# EasyEDA Pro project Fan_12V_LED.epro

# Schematic Schematic2_2
Board Name: Board2_12V_LED; Create Date: 2025-06-06; Page Name: P1; Project Name: Fan; Schematic Name: Schematic2_2; Update Date: 2025-07-09; Company: 嘉立创EDA; Page Size: A4; Version: V1.0
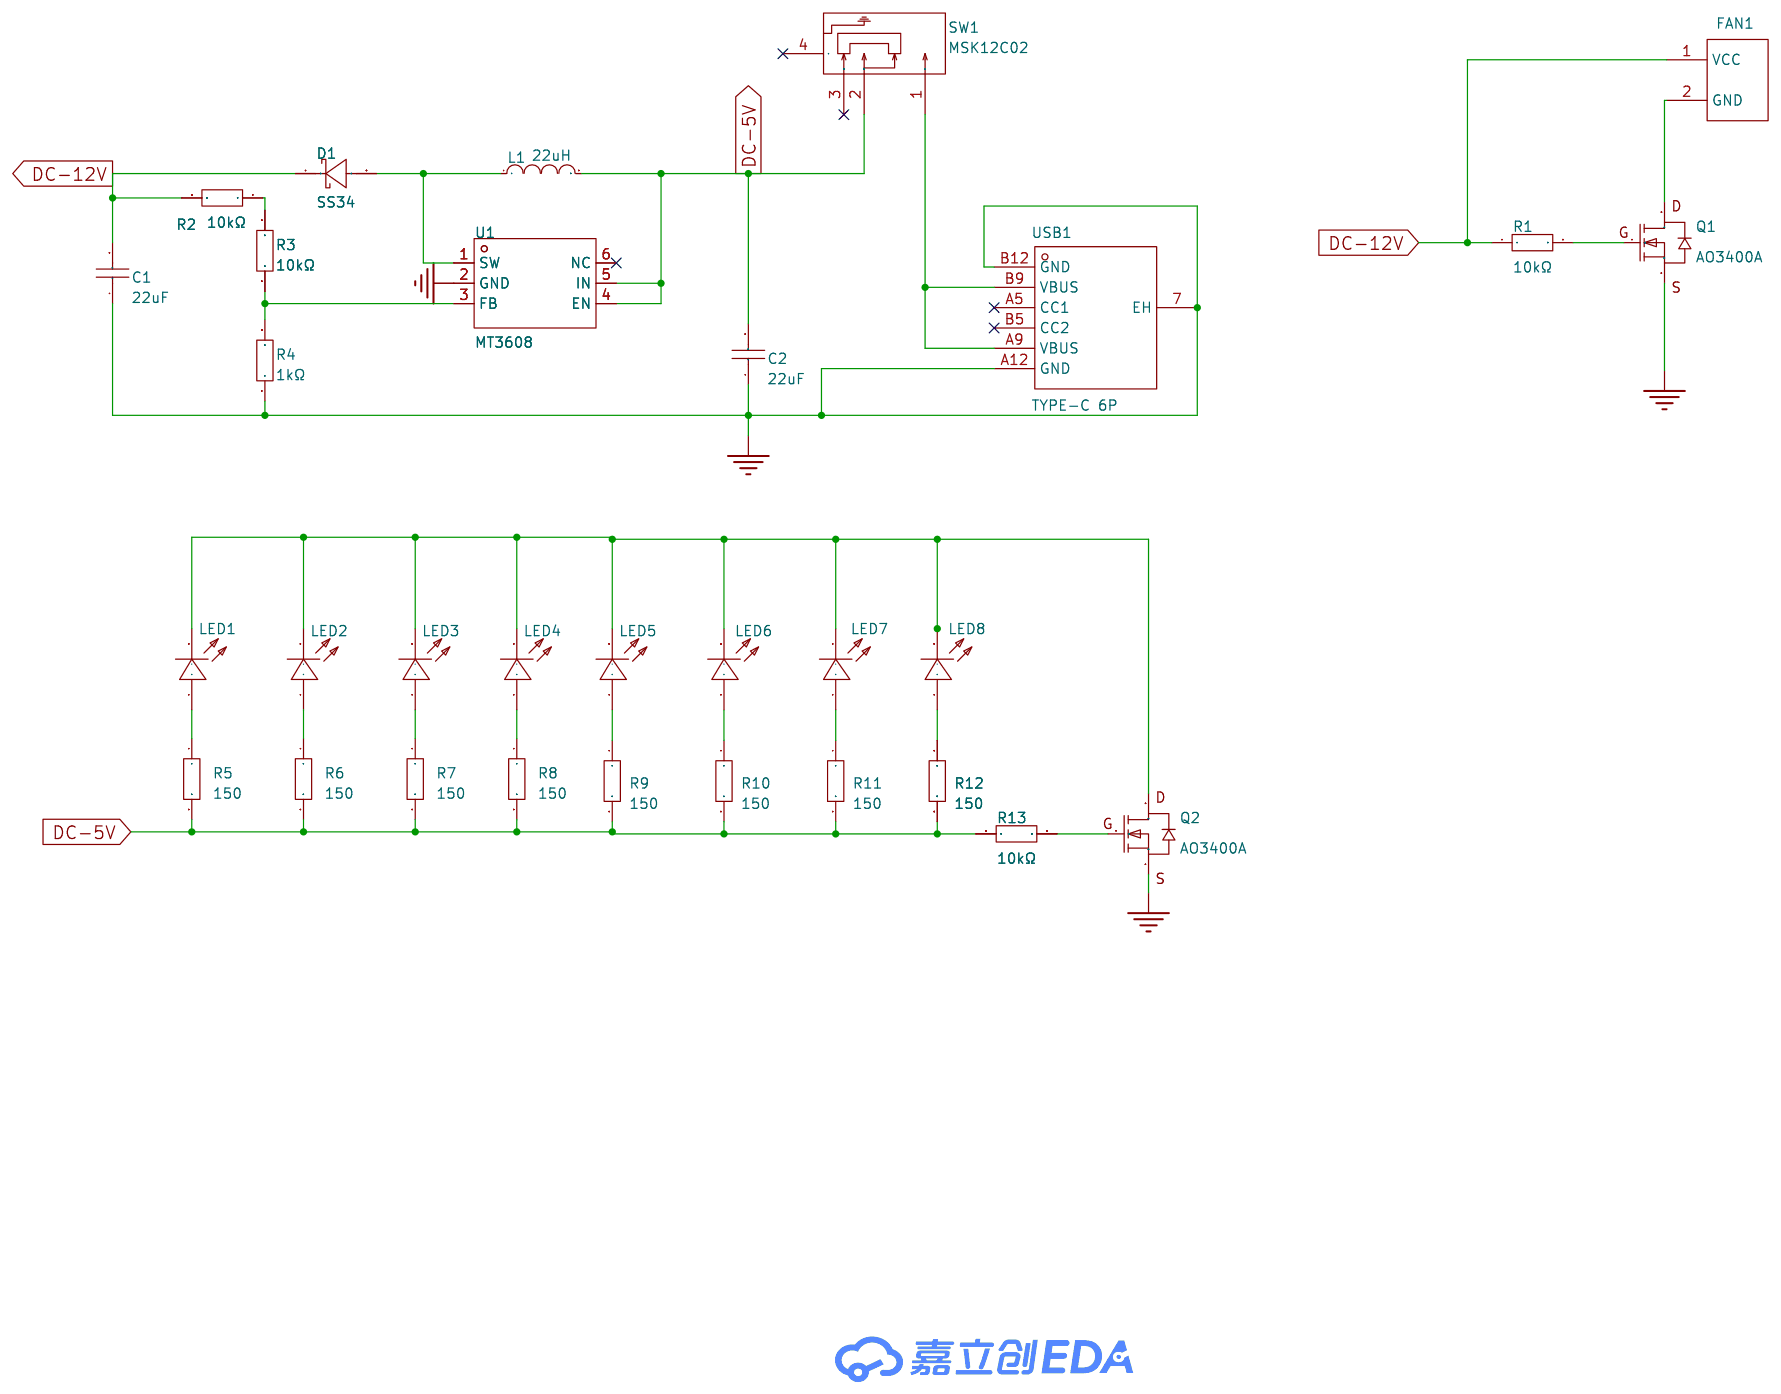
[diagram p0: schematic sheet]

## Parts
C1  22uF  [C0603]
C2  22uF  [C0603]
D1  SS34  [SMA_L4.2-W2.7-LS5.0-RD]
FAN1  -  [锂电池焊盘封装]
L1  22uH  [IND-SMD_L7.0-W6.6_FXL0630]
LED1  NCD0805R1  [LED0805-R-RD]
LED2  NCD0805R1  [LED0805-R-RD]
LED3  NCD0805R1  [LED0805-R-RD]
LED4  NCD0805R1  [LED0805-R-RD]
LED5  NCD0805R1  [LED0805-R-RD]
LED6  NCD0805R1  [LED0805-R-RD]
LED7  NCD0805R1  [LED0805-R-RD]
LED8  NCD0805R1  [LED0805-R-RD]
Q1  AO3400A  [SOT-23-3_L2.9-W1.3-P1.90-LS2.4-BR]
Q2  AO3400A  [SOT-23-3_L2.9-W1.3-P1.90-LS2.4-BR]
R1  10kΩ  [R0603]
R2  10kΩ  [R0603]
R3  10kΩ  [R0603]
R4  1kΩ  [R0603]
R5  150  [R0603]
R6  150  [R0603]
R7  150  [R0603]
R8  150  [R0603]
R9  150  [R0603]
R10  150  [R0603]
R11  150  [R0603]
R12  150  [R0603]
R13  10kΩ  [R0603]
SW1  MSK12C02  [SW-TH_MSK12C02]
U1  MT3608  [SOT-23-6_L2.9-W1.6-P0.95-LS2.8-BL]
USB1  TYPE-C 6P  [TYPE-C-SMD_TYPE-C-6P]

## Library data of the parts
C1 C2 = CC0603MRX5R5BB226: 容值:22uF;精度:±20%;额定电压:6.3V;材质(温度系数):X5R;; LCSC Part Name: 22uF ±20% 6.3V; Supplier Part: C109448; Manufacturer: YAGEO(国巨); Supplier Footprint: 0603; JLCPCB Part Class: 扩展库; Datasheet: https://atta.szlcsc.com/upload/public/pdf/source/20180326/C109448_EB54A0A53A47321976FFDA89D54F692E.pdf; Supplier: LCSC; Tolerance: ±20%; Voltage Rated: 6.3V; Temperature Coefficient: X5R
D1 = SS34_C2837271: 二极管配置:-;正向压降(Vf):550mV@3A;直流反向耐压(Vr):40V;整流电流:3A;; LCSC Part Name: 电压:40V 电流:3A; Supplier Part: C2837271; Manufacturer: JSMSEMI(杰盛微); Supplier Footprint: SMA(DO-214AC); JLCPCB Part Class: 扩展库; Datasheet: https://atta.szlcsc.com/upload/public/pdf/source/20240105/68F24DC3F5F89CC64C93FD752A02EDA3.pdf; Supplier: LCSC; Forward Voltage (Vf@If): 550mV@3A; Reverse Voltage (Vr): 40V; Rectified Current: 3A; Reverse Leakage Current (Ir): 500uA@40V
FAN1 = 锂电池焊盘
L1 = FXL0630-220-M: 电感值:22uH;精度:±20%;额定电流:2.5A;饱和电流(Isat):3A;类型:一体成型电感;; LCSC Part Name: 22uH ±20% 3A; Supplier Part: C177244; Manufacturer: cjiang(长江微电); Supplier Footprint: SMD,6.6x7mm; JLCPCB Part Class: 扩展库; Datasheet: https://atta.szlcsc.com/upload/public/pdf/source/20240426/3189EA8206330E2108542F9E34E540E7.pdf; Supplier: LCSC; Tolerance: ±20%; Rated Current: 2.5A; Saturation Current (Isat): 3A; DC Resistance (DCR): 200mΩ; Type: 一体成型电感
LED1-LED8 = NCD0805R1: 灯头类型:-;发光颜色:红色;正向电压(VF):1.6V~2.6V;功率:65mW;正向电流:20mA;主波长:615nm~630nm;二极管配置:独立二极管;透镜颜色:无色透明透镜;色温:-;发光强度:67mcd~195mcd;发光角度:130°;载带方式:-;工作温度:-30℃~+85℃;; Supplier Part: C84256; Manufacturer: 国星光电; Supplier Footprint: 0805; JLCPCB Part Class: 基础库; Datasheet: https://atta.szlcsc.com/upload/public/pdf/source/20200820/C84256_F0A75A43B3EAD75808600A0514C76B99.pdf; Supplier: LCSC; Emitted Color: 红色; Forward Voltage (VF): 1.6V~2.6V; Power Dissipation: 65mW; Forward Current: 20mA; Dominant Wavelength: 615nm~630nm; Diode Configuration: 独立二极管; Lens Color: 无色透明透镜; Luminous Intensity: 67mcd~195mcd; Viewing Angle: 130°; Operating Temperature: -30℃~+85℃
Q1 Q2 = AO3400A_C347475: 类型:1个N沟道;漏源电压(Vdss):30V;连续漏极电流(Id):5.8A;导通电阻(RDS(on)@Vgs,Id):28mΩ@10V,5.8A;功率(Pd):1.4W;阈值电压(Vgs(th)@Id):1.4V@250uA;; LCSC Part Name: 1个N沟道 耐压:30V 电流:5.8A; Supplier Part: C347475; Manufacturer: UMW(友台半导体); Supplier Footprint: SOT-23; JLCPCB Part Class: 扩展库; Datasheet: https://atta.szlcsc.com/upload/public/pdf/source/20231109/50AB4FB4D66E55864F9B8D027B723C9A.pdf; Supplier: LCSC; Type: 1个N沟道; Drain Source Voltage (Vdss): 30V; Continuous Drain Current (Id): 5.8A; Drain Source On Resistance (RDS(on)@Vgs,Id): 28mΩ@10V,5.8A; Power Dissipation (Pd): 1.4W; Gate Threshold Voltage (Vgs(th)@Id): 1.4V@250uA; Total Gate Charge (Qg@Vgs): 12nC@10V; Input Capacitance (Ciss@Vds): 1.05nF@24V; Reverse Transfer Capacitance (Crss@Vds): 77pF@15V; Operating Temperature: -55℃~+150℃
R1 R13 = RC0603FR-0710KL: 电阻类型:厚膜电阻;阻值:10kΩ;精度:±1%;功率:100mW;最大工作电压:75V;温度系数:±100ppm/℃;; LCSC Part Name: 厚膜电阻 10kΩ ±1% 100mW; Supplier Part: C98220; Manufacturer: YAGEO(国巨); Supplier Footprint: 0603; JLCPCB Part Class: 扩展库; Datasheet: https://atta.szlcsc.com/upload/public/pdf/source/20180927/C295883_E8D83085EA81BD7DE0B2B681138C15EE.pdf; Supplier: LCSC; Type: 厚膜电阻; Tolerance: ±1%; Power(Watts): 100mW; Overload Voltage (Max): 75V; Temperature Coefficient: ±100ppm/℃; Operating Temperature Range: -55℃~+155℃
R2 R3 = RC0603FR-0710KL: 电阻类型:厚膜电阻;阻值:10kΩ;精度:±1%;功率:100mW;最大工作电压:75V;温度系数:±100ppm/℃;; LCSC Part Name: 厚膜电阻 10kΩ ±1% 100mW; Supplier Part: C98220; Manufacturer: YAGEO(国巨); Supplier Footprint: 0603; JLCPCB Part Class: Extended Part; Datasheet: https://atta.szlcsc.com/upload/public/pdf/source/20180927/C295883_E8D83085EA81BD7DE0B2B681138C15EE.pdf; Supplier: LCSC; Type: 厚膜电阻; Tolerance: ±1%; Power(Watts): 100mW; Overload Voltage (Max): 75V; Temperature Coefficient: ±100ppm/℃; Operating Temperature Range: -55℃~+155℃
R4 = RC0603FR-071KL: 电阻类型:厚膜电阻;阻值:1kΩ;精度:±1%;功率:100mW;工作电压:75V;温度系数:±100ppm/℃;; LCSC Part Name: 厚膜电阻 1kΩ ±1% 100mW; Supplier Part: C22548; Manufacturer: YAGEO(国巨); Supplier Footprint: 0603; JLCPCB Part Class: Extended Part; Datasheet: https://atta.szlcsc.com/upload/public/pdf/source/20180316/70C0E2BDAE7FCC62C531A5A58D202EE1.pdf; Supplier: LCSC; Type: 厚膜电阻; Tolerance: ±1%; Power(Watts): 100mW; Voltage-Supply(Max): 75V; Temperature Coefficient: ±100ppm/℃; Operating Temperature: -55℃~+155℃
R5-R12 = 0603WAF1003T5E: 电阻类型:厚膜电阻;阻值:100kΩ;精度:±1%;功率:100mW;最大工作电压:75V;温度系数:±100ppm/℃;; LCSC Part Name: 100kΩ ±1% 100mW 厚膜电阻; Supplier Part: C25803; Manufacturer: UNI-ROYAL(厚声); Supplier Footprint: 0603; JLCPCB Part Class: 基础库; Datasheet: https://atta.szlcsc.com/upload/public/pdf/source/20200306/C422600_1E6D84923E4A46A82E41ADD87F860B5C.pdf; Supplier: LCSC; Type: 厚膜电阻; Tolerance: ±1%; Power(Watts): 100mW; Overload Voltage (Max): 75V; Temperature Coefficient: ±100ppm/℃; Operating Temperature Range: -55℃~+155℃
SW1 = MSK12C02: 电路结构:单刀双掷;安装方式:卧贴;开关颜色:-;额定电流(DC):50mA;额定电压(DC):12V;额定电流(AC):-;额定电压(AC):-;机械寿命:1万次;; LCSC Part Name: 两档侧拨贴片 7脚 滑动开关; Supplier Part: C431540; Manufacturer: SHOU HAN(首韩); Supplier Footprint: SMD; JLCPCB Part Class: 扩展库; Datasheet: https://atta.szlcsc.com/upload/public/pdf/source/20190925/C431540_89155AEF0758B9AD1B2D805F83FB12E3.pdf; Supplier: LCSC; Circuit: 单刀双掷; Pin Style: SMD接片; Switch Length: 8mm; Switch Width: 2.8mm; Switch Height: 1.4mm; Mounting Style: 卧贴; Current Rating (DC): 50mA; Voltage Rating (DC): 12V; Mechanical Life: 1万次; Operating Temperature: -20℃~+70℃
U1 = MT3608: 功能类型:升压型;输出类型:可调;工作电压:2V~24V;输出电压:28V;输出电流:2A;; LCSC Part Name: 高效1.2MHz 2A升压转换器; Supplier Part: C84817; Manufacturer: 西安航天民芯; Supplier Footprint: SOT-23-6; JLCPCB Part Class: 扩展库; Datasheet: https://atta.szlcsc.com/upload/public/pdf/source/20161110/1478743351706.pdf; Supplier: LCSC; Function: 升压型; Output Type: 可调; Input Voltage: 2V~24V; Output Voltage: 28V; Output Current: 2A; Switching Frequency: 1.2MHz; Operating Temperature: -40℃~+85℃; Synchronous Rectification: 否; Number of Outputs: 1; Topology: 升压式; Quiescent Current (Iq): 200uA; Switch tube (built-in/external): 内置
USB1 = TYPE-C 6P: 连接器类型:Type-C;标准:USB 3.1;公母:母;安装方式:卧贴;触点数量:6P;端口数量:1;额定电流 - 电源:5A;工作温度范围:-40℃~+85℃;; LCSC Part Name: Type-C 母 卧贴; Supplier Part: C456012; Manufacturer: SHOU HAN(首韩); Supplier Footprint: SMD; JLCPCB Part Class: 扩展库; Datasheet: https://atta.szlcsc.com/upload/public/pdf/source/20201203/C456012_B13F72044DF846EDBE9BDD0D1D3CD166.pdf; Supplier: LCSC; Connector Type: Type-C; Standard: USB 3.1; Gender: 母; Mounting Style: 卧贴; Number of Contacts: 6P; Number of Ports: 1; Current Rating - Power (Max): 5A; Operating Temperature Range: -40℃~+85℃; Rated Voltage (Max): 20V; Connect-Disconnect Life: 3千次; Core Colour: 黑色

## Nets
GND: C1.1 C2.1 Q1.2(S) Q2.2(S) R4.1 U1.2(GND) USB1.7(EH) USB1.A12(GND) USB1.B12(GND)
DC-5V: C2.2 L1.2 R5.2 R6.2 R7.2 R8.2 R9.2 R10.2 R11.2 R12.2 R13.1 SW1.2 U1.4(EN) U1.5(IN)
DC-12V: C1.2 D1.1(K) FAN1.1(VCC) R1.1 R2.2
$1N345: LED1.1(+) R5.1
$1N949: LED2.1(+) R6.1
$1N954: LED3.1(+) R7.1
$1N959: LED4.1(+) R8.1
$1N8618: LED5.1(+) R9.1
$1N8621: LED6.1(+) R10.1
$1N8622: LED7.1(+) R11.1
$1N8623: LED8.1(+) R12.1
$1N23173: Q1.1(G) R1.2
$1N23177: R3.1 R4.2 U1.3(FB)
$1N23179: D1.2(A) L1.1 U1.1(SW)
$1N23180: R2.1 R3.2
$1N23186: SW1.1 USB1.A9(VBUS) USB1.B9(VBUS)
$1N23217: LED1.2(-) LED2.2(-) LED3.2(-) LED4.2(-) LED5.2(-) LED6.2(-) LED7.2(-) LED8.2(-) Q2.3(D)
$1N23332: Q2.1(G) R13.2
Net-(FAN1-2): FAN1.2(GND) Q1.3(D)

Not connected (* = marked no-connect by the designer): SW1 3* 4*; U1 6(NC)*; USB1 A5(CC1)* B5(CC2)*

# Board PCB2_2
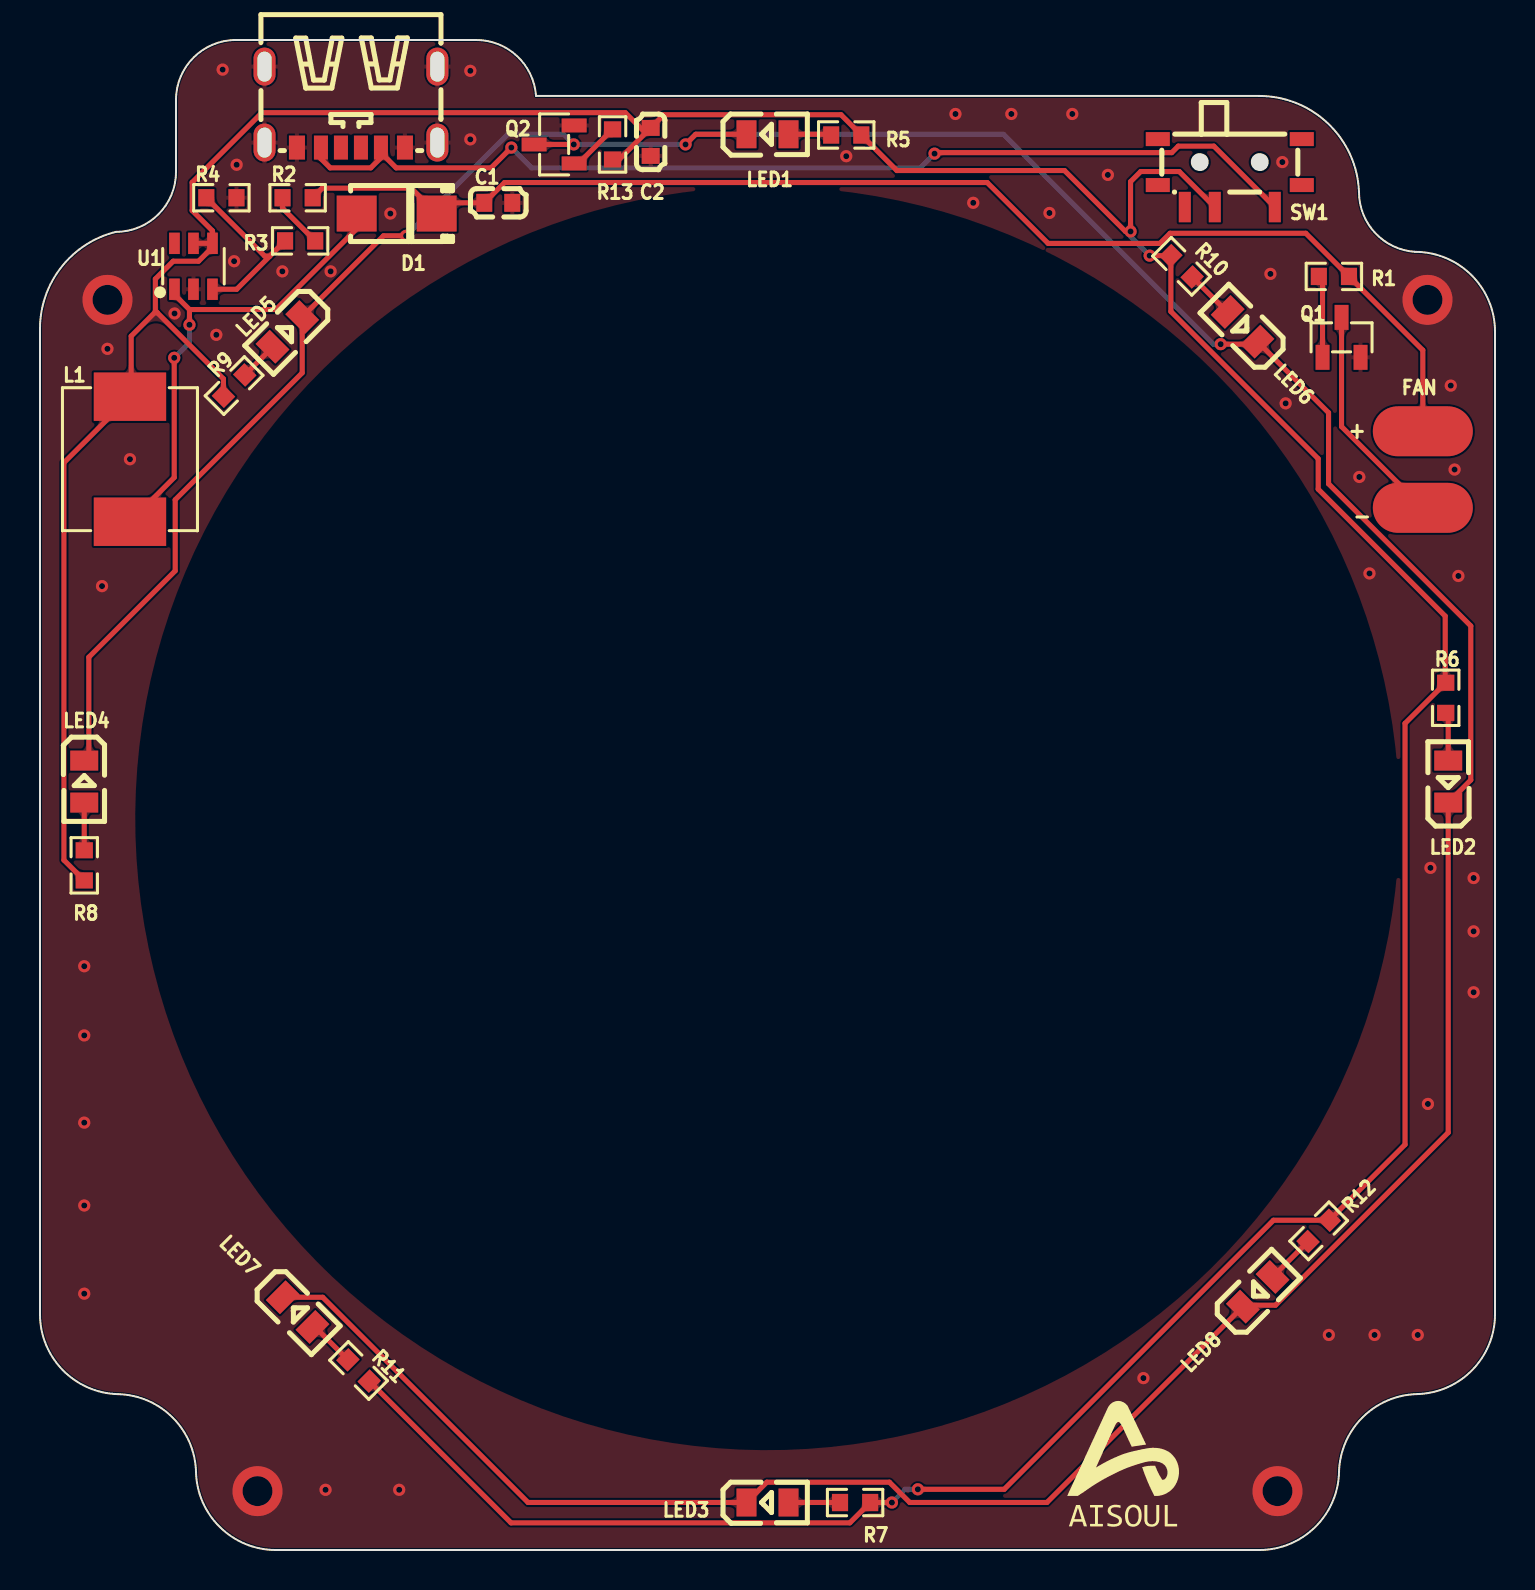
[diagram p1: board, top side]
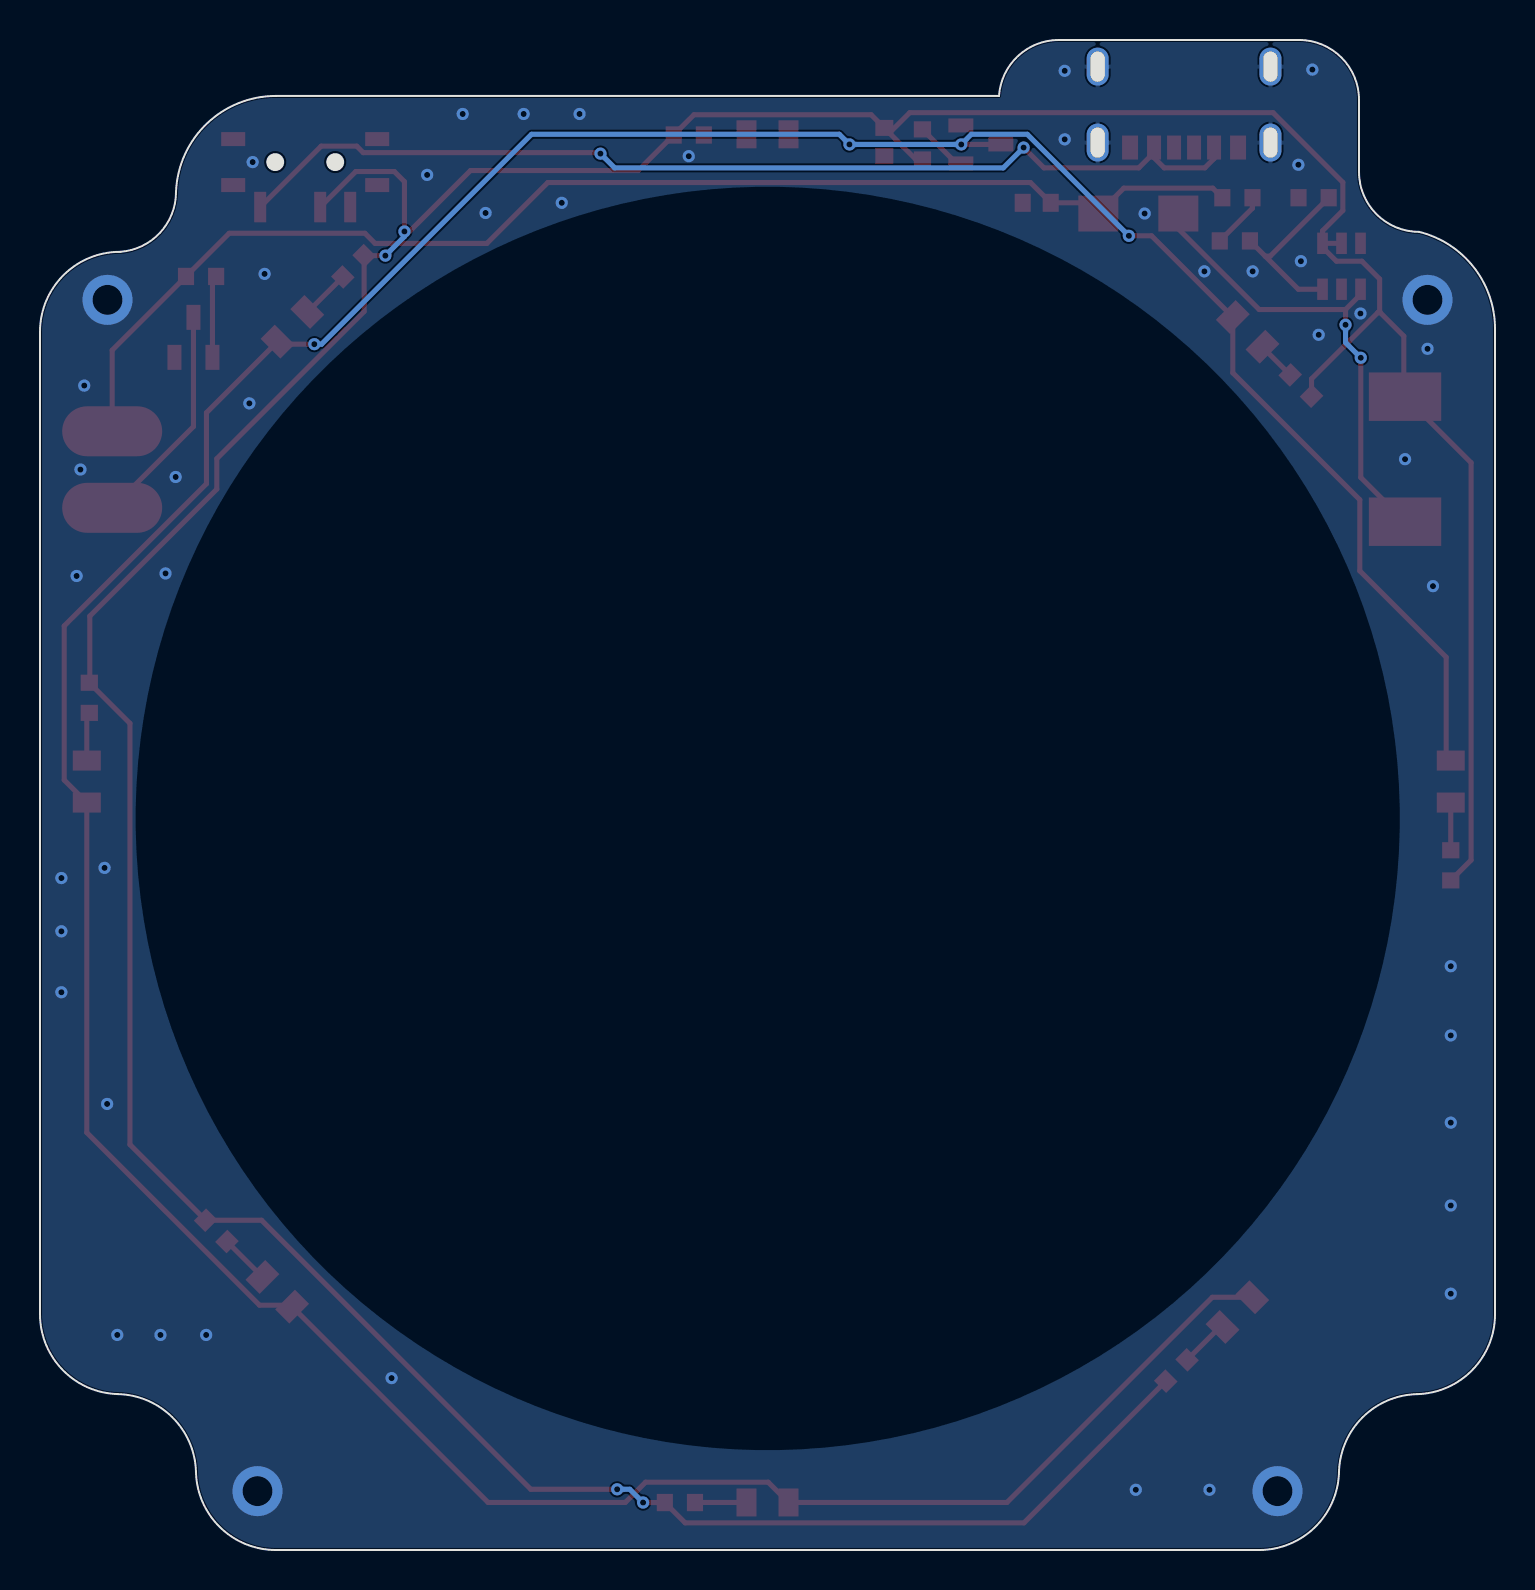
[diagram p2: board, bottom side, seen from below]

Outline 72.75 x 75.55 mm; copper layers: Top Layer, Bottom Layer. Coordinates in mm from the lower left corner of the outline.
Outline path: 0,61.1 0,11.8 arc(1.14,9) 3.9,7.8 arc(6.63,6.63) 7.8,3.9 arc(9.01,1.14) 11.8,0 60.95,0 arc(63.75,1.14) 64.95,3.9 arc(66.12,6.63) 68.85,7.8 arc(71.61,9.01) 72.75,11.8 72.75,60.95 arc(71.58,63.78) 68.75,64.95 arc(66.76,65.89) 65.95,67.94 arc(64.42,71.35) 60.95,72.75 24.8,72.75 arc(23.86,74.74) 21.81,75.55 9.8,75.55 arc(7.68,74.67) 6.8,72.55 6.8,68.95 arc(5.92,66.83) 3.8,65.95 arc(1.06,64.18) 0,61.1
Stack: Top Layer 0.035mm / Dielectric1 1.51mm FR4 er 4.5 / Bottom Layer 0.035mm

## Design rules (mm)
template: 自定义配置
spacing copperThickness1oz (default): track to track 0.102, other pairs 0.152 to 0.3
spacing copperThickness2oz: track to track 0.203, other pairs 0.152 to 0.3
track width copperThickness1oz (default): min 0.127, default 0.254, max 2.54
track width copperThickness2oz: min 0.203, default 0.254, max 2.54
differential pair differentialPair (default): width min 0.127, default 0.254, max 2.54; gap min 0.152, default 0.152
via viaSize (default): diameter min 0.5, default 0.61, max 10; hole min 0.3, default 0.305, max 6.3

## Placement (name value [footprint] x y rotation side)
C1  22uF  [C0603]  22.91 67.4 180 top
C2  22uF  [C0603]  30.53 70.45 90 top
D1  SS34  [SMA_L4.2-W2.7-LS5.0-RD]  17.83 66.87 180 top
FAN  -  [锂电池焊盘封装]  69.14 54.07 0 top
L1  22uH  [IND-SMD_L7.0-W6.6_FXL0630]  4.5 54.58 270 top
LED1  NCD0805R1  [LED0805-R-RD]  36.38 70.83 0 top
LED2  NCD0805R1  [LED0805-R-RD]  70.41 38.45 90 top
LED3  NCD0805R1  [LED0805-R-RD]  36.38 2.38 0 top
LED4  NCD0805R1  [LED0805-R-RD]  2.21 38.45 270 top
LED5  NCD0805R1  [LED0805-R-RD]  12.37 60.95 225 top
LED6  NCD0805R1  [LED0805-R-RD]  60.13 61.2 135 top
LED7  NCD0805R1  [LED0805-R-RD]  12.88 11.9 315 top
LED8  NCD0805R1  [LED0805-R-RD]  60.89 12.92 45 top
Q1  AO3400A  [SOT-23-3_L2.9-W1.3-P1.90-LS2.4-BR]  65.08 60.67 270 top
Q2  AO3400A  [SOT-23-3_L2.9-W1.3-P1.90-LS2.4-BR]  25.71 70.32 0 top
R1  10kΩ  [R0603]  64.7 63.72 180 top
R2  10kΩ  [R0603]  12.88 67.66 0 top
R3  10kΩ  [R0603]  13.01 65.5 0 top
R4  1kΩ  [R0603]  9.07 67.66 180 top
R5  150  [R0603]  40.31 70.79 0 top
R6  150  [R0603]  70.28 42.64 90 top
R7  150  [R0603]  40.75 2.38 0 top
R8  150  [R0603]  2.21 34.26 270 top
R9  150  [R0603]  9.7 58.26 225 top
R10  150  [R0603]  57.08 64.23 135 top
R11  150  [R0603]  15.93 8.98 315 top
R12  150  [R0603]  63.93 15.97 45 top
R13  10kΩ  [R0603]  28.63 70.32 90 top
SW1  MSK12C02  [SW-TH_MSK12C02]  59.49 68.89 180 top
U1  MT3608  [SOT-23-6_L2.9-W1.6-P0.95-LS2.8-BL]  7.67 64.23 0 top
USB1  TYPE-C 6P  [TYPE-C-SMD_TYPE-C-6P]  15.55 72.19 180 top

## Footprints (pads in the part's own frame, mm; a bottom-side part is the same pattern mirrored in y, then rotated)
C0603
  rect 0.8x0.9 smd: 1(-0.7,0) 2(0.7,0)
IND-SMD_L7.0-W6.6_FXL0630
  rect 2.424x3.62 smd: 1(3.128,0) 2(-3.128,0)
LED0805-R-RD
  rect 1x1.399 smd: 1(1.05,0) 2(-1.05,0)
R0603
  rect 0.806x0.864 smd: 1(-0.753,0) 2(0.753,0)
SMA_L4.2-W2.7-LS5.0-RD
  rect 2x1.8 smd: 1(-2,0) 2(2,0)
SOT-23-3_L2.9-W1.3-P1.90-LS2.4-BR
  rect 1.25x0.7 smd: 1(1,-0.95) 2(1,0.95) 3(-1,0)
SOT-23-6_L2.9-W1.6-P0.95-LS2.8-BL
  rect 0.532x1.072 smd: 1(-0.95,-1.149) 2(0,-1.149) 3(0.95,-1.149) 4(0.95,1.149) 5(0,1.149) 6(-0.95,1.149)
SW-TH_MSK12C02
  rect 0.6x1.524 smd: 1(-2.25,1.7) 2(0.75,1.7) 3(2.25,1.7)
  rect 1.2x0.7 smd: 4(-3.6,0.6) 4(-3.6,-1.7) 4(3.6,0.6) 4(3.6,-1.7)
TYPE-C-SMD_TYPE-C-6P
  oval 1.1x1.9 hole 0.7x1.5: 7(-4.32,1.775) 7(-4.32,-2.025) 7(4.32,1.775) 7(4.32,-2.025)
  rect 0.7x1.2 smd: A5(-0.5,2.025) A9(1.5,2.025) B5(0.5,2.025) B9(-1.5,2.025)
  rect 0.8x1.2 smd: A12(2.7,2.025) B12(-2.7,2.025)
锂电池焊盘封装
  oval 5x2.5 smd: 1(0,1.905) 2(0,-1.924)

## Nets
As in the schematic, except:
DC-12V: C1.2 D1.1 FAN.1 R1.1 R2.2
$1N23187: FAN.2 Q1.3

Pads without a net: SW1 3 4; U1 6; USB1 A5 B5

## Via types
v1: diameter 0.61, hole 0.305, Top Layer to Bottom Layer, 56 vias
v2: diameter 2.5, hole 1.5, Top Layer to Bottom Layer, 4 vias

## Routing (per net, layer and track width the routed paths; a pad name or vN(x,y) marks a point on that pad's centre or on a via; arc(x,y) is an arc through that point)
GND:
  vias: v1(2.21,29.21) v1(2.21,25.75) v1(2.21,21.38) v1(2.21,17.24) v1(2.21,12.82) v1(3.1,48.23) v1(3.37,60.1) v1(4.5,54.58) v1(6.73,61.87) v1(8.82,60.8) v1(9.13,74.07) v1(9.7,64.48) v1(9.83,69.31) v1(12.12,63.97) v1(14.28,3.01) v1(14.53,63.97) v1(17.52,66.87) v1(17.96,3.01) v1(21.52,74.01) v1(21.52,70.58) v1(40.31,69.74) v1(45.77,71.85) v1(46.66,67.4) v1(48.57,71.85) v1(50.47,66.89) v1(51.62,71.85) v1(53.39,68.8) v1(55.17,8.6) v1(61.52,63.85) v1(62.12,69.44) v1(62.28,57.37) v1(64.44,10.76) v1(65.97,53.69) v1(66.47,48.86) v1(66.73,10.76) v1(68.89,10.76) v1(69.4,22.32) v1(69.52,34.13) v1(70.54,58.26) v1(70.73,54.06) v1(70.92,48.73) v1(71.68,33.62) v1(71.68,30.95) v1(71.68,27.91) v2(3.38,62.55) v2(10.88,2.95) v2(61.88,2.95) v2(69.38,62.55)
DC-5V: length 224
  Top Layer w0.254: R9.2 9.17,58.59 5.86,61.91 ; 5.86,61.91 5.73,61.91 4.56,60.73 4.56,57.76 L1.2 1.2,54.4 1.2,34.52 R8.2 ; 5.86,61.91 5.77,62 5.77,63.59 6.66,64.48 7.93,64.48 8.5,65.06 8.5,65.38 ; SW1.2 56.96,68.97 55.04,68.97 54.53,68.46 v1(54.53,65.97) 54.27,65.97 51.23,69.02 42.84,69.02 R5.2 40.05,71.81 31.19,71.81 C2.2 30.28,70.9 ; 8.62,65.49 8.62,66 7.61,67.02 7.61,68.42 11.09,71.91 29.26,71.91 30.28,70.9 ; 8.62,65.49 U1.4 8.5,65.38 ; 8.62,65.49 8.5,65.38 ; R13.1 28.95,69.57 30.28,70.9 ; 8.5,65.38 U1.5 ; v1(43.89,3.04) 48.21,3.04 61.67,16.5 R12.2 68.25,20.29 68.25,41.36 R6.2 70.26,43.42 70.26,46.73 63.91,53.08 63.91,54.6 56.54,61.97 R10.2 v1(55.48,64.76) ; R11.2 23.55,1.36 40.49,1.36 R7.2 v1(42.6,2.38)
  Bottom Layer w0.254: v1(54.53,65.97) 54.53,65.71 v1(55.48,64.76) ; v1(43.89,3.04) 43.26,3.04 v1(42.6,2.38)
DC-12V: length 64.8
  Top Layer w0.254: FAN.1 69.14,60.03 R1.1 63.29,65.88 56.5,65.88 56,65.37 50.41,65.37 47.36,68.42 23.23,68.42 C1.2 20.37,67.4 D1.1 18.56,68.14 14.11,68.14 R2.2
$1N345: length 2.1
  Top Layer w0.254: R5.1 39.52,70.83 LED1.1
$1N949: length 2.4
  Top Layer w0.254: LED2.1 70.41,41.76 R6.1
$1N954: length 2.6
  Top Layer w0.254: LED3.1 40,2.38
$1N959: length 2.4
  Top Layer w0.254: LED4.1 R8.1
$1N8618: length 2
  Top Layer w0.254: LED5.1 11.62,60.18 R9.1
$1N8621: length 2.5
  Top Layer w0.254: LED6.1 59.36,61.94 R10.1
$1N8622: length 2.5
  Top Layer w0.254: LED7.1 13.75,11.16 R11.1
$1N8623: length 2.5
  Top Layer w0.254: LED8.1 R12.1
$1N23173: length 4.1
  Top Layer w0.254: Q1.1 64.13,63.53 R1.2
$1N23177: length 9
  Top Layer w0.254: 11.49,64.74 9.83,63.08 U1.3 ; 11.49,64.74 11.24,64.74 R4.2 ; 11.49,64.74 R3.1
$1N23179: length 24
  Top Layer w0.254: 7.47,62.06 11.79,62.06 15.83,66.1 D1.2 ; 7.47,62.06 6.72,62.81 U1.1 ; 7.47,62.06 v1(7.47,61.3) ; L1.1 6.71,53.66 v1(6.71,59.65)
  Bottom Layer w0.254: v1(6.71,59.65) 7.47,60.41 v1(7.47,61.3)
$1N23180: length 2.8
  Top Layer w0.254: R2.1 12.13,67.13 R3.2
$1N23186: length 52
  Top Layer w0.254: v1(44.73,69.86) 44.78,69.91 56.59,69.91 56.91,70.24 58.69,70.24 SW1.1 ; 17.05,69.91 17.81,69.15 22.55,69.15 v1(23.57,70.17) ; 17.05,69.91 USB1.B9 ; 17.05,69.91 17.05,69.66 16.54,69.15 14.51,69.15 14.05,69.61 USB1.A9
  Bottom Layer w0.254: v1(44.73,69.86) 44.01,69.15 24.58,69.15 v1(23.57,70.17)
$1N23187: length 11.2
  Top Layer w0.254: FAN.2 65.08,56.21 Q1.3
$1N23217: length 203.8
  Top Layer w0.254: v1(59.03,60.33) 60.74,60.33 LED6.2 64.43,56.9 64.43,53.35 71.54,46.23 71.54,38.52 LED2.2 70.41,20.89 61.78,12.25 60.22,12.25 LED8.2 50.34,2.38 43.49,2.38 42.47,3.39 36.34,3.39 LED3.2 24.4,2.38 14.14,12.65 LED7.2 ; v1(18.31,65.75) 17.17,65.75 LED5.2 13.11,58.89 6.76,52.54 6.76,48.99 2.44,44.67 2.44,39.73 LED4.2 ; LED1.2 32.78,70.83 v1(32.28,70.32) ; v1(26.69,70.32) Q2.3
  Bottom Layer w0.254: v1(59.03,60.33) 58.67,60.33 48.17,70.83 32.78,70.83 v1(32.28,70.32) v1(26.69,70.32) 26.18,70.83 23.39,70.83 v1(18.31,65.75)
$1N23332: length 2.6
  Top Layer w0.254: 26.71,69.37 26.92,69.37 R13.2

## Copper pours and planes (outline as drawn; the poured copper is in the pictures)
GND on Top Layer: -2.11,78.07 75.36,78.07 75.36,-1.43 -2.11,-1.43
GND on Bottom Layer: -5.41,80.23 77.27,80.23 77.27,-3.21 -5.41,-3.21

Small or netless copper shapes (teardrops, artwork), in the pictures only: 92 on Top Layer, 14 on Bottom Layer

## Text on the board
Top Silkscreen Layer: + | -
